# EAGLE design FT232H (EAGLE 6.5.0)
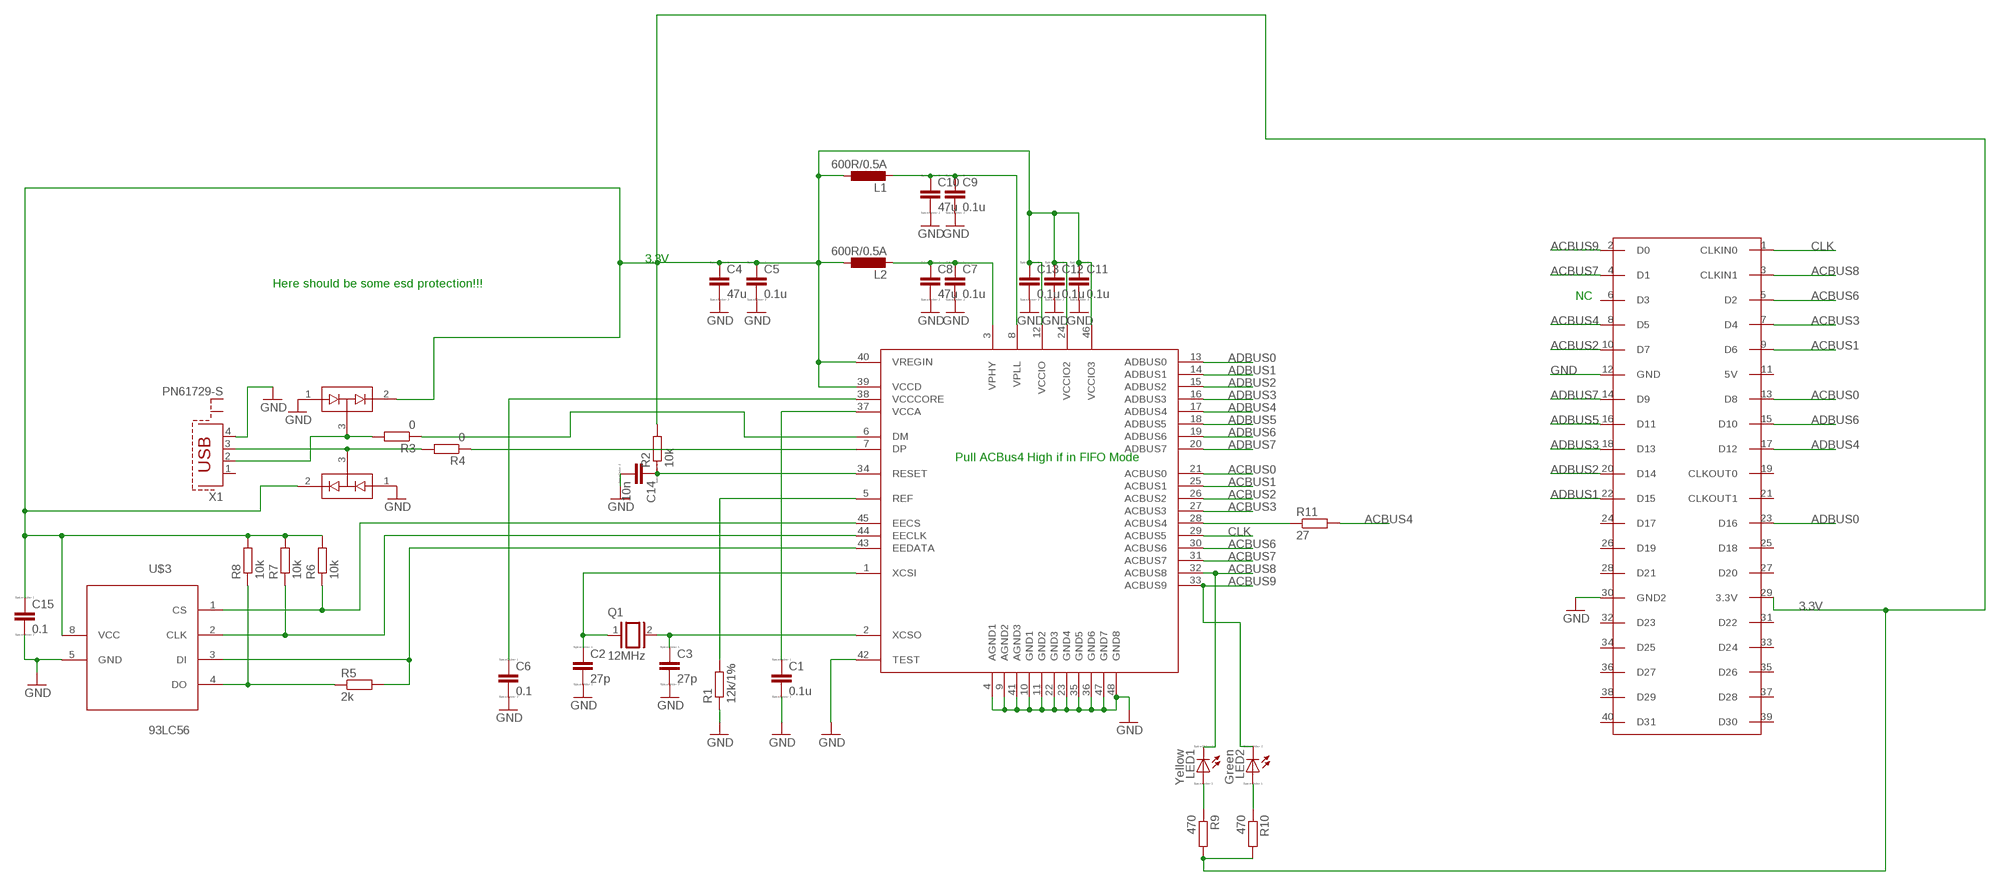
[diagram p0: schematic, sheet 1]

## Parts
C1  0.1u  C_SMD  [C0805]
C2  27p  C_SMD  [C0805]
C3  27p  C_SMD  [C0805]
C4  47u  C_SMD  [C0805]
C5  0.1u  C_SMD  [C0805]
C6  0.1  C_SMD  [C0805]
C7  0.1u  C_SMD  [C0805]
C8  47u  C_SMD  [C0805]
C9  0.1u  C_SMD  [C0805]
C10  47u  C_SMD  [C0805]
C11  0.1u  C_SMD  [C0805]
C12  0.1u  C_SMD  [C0805]
C13  0.1u  C_SMD  [C0805]
C14  10n  C_SMD  [C0805]
C15  0.1  C_SMD  [C0805]
D1  BAV99  [SOT23]
D2  BAV99  [SOT23]
L1  600R/0.5A  L_0805  [R0805]
L2  600R/0.5A  L_0805  [R0805]
LED1  Yellow  LED_ELED_0805  [R0805]
LED2  Green  LED_ELED_0805  [R0805]
Q1  12MHz  XTAL/S  [QS]
R1  12k/1%  R-EU_M0805  [M0805]
R2  10k  R-EU_M0805  [M0805]
R3  0  R-EU_M0805  [M0805]
R4  0  R-EU_M0805  [M0805]
R5  2k  R-EU_M0805  [M0805]
R6  10k  R-EU_M0805  [M0805]
R7  10k  R-EU_M0805  [M0805]
R8  10k  R-EU_M0805  [M0805]
R9  470  R-EU_M0805  [M0805]
R10  470  R-EU_M0805  [M0805]
R11  27  R-EU_M0805  [M0805]
U$1  FT232H  [LQFP48]
U$2  FPGA_GPIO_DE0  [2X20]
U$3  93LC56  [DIL-08]
X1  PN61729-S  [PN61729-S]

## Nets
3.3V: C4.1 C5.1 C11.1 C12.1 C13.1 C15.1 D1.2(C2) D2.2(C2) L1.1 L2.1 R2.2 R6.2 R7.2 R8.2 R9.2 R10.2 U$1.12(VCCIO) U$1.24(VCCIO2) U$1.39(VCCD) U$1.40(VREGIN) U$1.46(VCCIO3) U$2.29(3.3V) U$3.8(VCC)
ACBUS0: U$1.21(ACBUS0) U$2.13(D8)
ACBUS1: U$1.25(ACBUS1) U$2.9(D6)
ACBUS2: U$1.26(ACBUS2) U$2.10(D7)
ACBUS3: U$1.27(ACBUS3) U$2.7(D4)
ACBUS4: R11.2 U$2.8(D5)
ACBUS6: U$1.30(ACBUS6) U$2.5(D2)
ACBUS7: U$1.31(ACBUS7) U$2.4(D1)
ACBUS8: LED1.2(C) U$1.32(ACBUS8) U$2.3(CLKIN1)
ACBUS9: LED2.2(C) U$1.33(ACBUS9) U$2.2(D0)
ADBUS0: U$1.13(ADBUS0) U$2.23(D16)
ADBUS1: U$1.14(ADBUS1) U$2.22(D15)
ADBUS2: U$1.15(ADBUS2) U$2.20(D14)
ADBUS3: U$1.16(ADBUS3) U$2.18(D13)
ADBUS4: U$1.17(ADBUS4) U$2.17(D12)
ADBUS5: U$1.18(ADBUS5) U$2.16(D11)
ADBUS6: U$1.19(ADBUS6) U$2.15(D10)
ADBUS7: U$1.20(ADBUS7) U$2.14(D9)
CLK: U$1.29(ACBUS5) U$2.1(CLKIN0)
GND: C1.2 C2.2 C3.2 C4.2 C5.2 C6.2 C7.2 C8.2 C9.2 C10.2 C11.2 C12.2 C13.2 C14.2 C15.2 D1.1(A1) D2.1(A1) R1.1 U$1.4(AGND1) U$1.9(AGND2) U$1.10(GND1) U$1.11(GND2) U$1.22(GND3) U$1.23(GND4) U$1.35(GND5) U$1.36(GND6) U$1.41(AGND3) U$1.42(TEST) U$1.47(GND7) U$1.48(GND8) U$2.12(GND) U$2.30(GND2) U$3.5(GND) X1.4
N$1: C9.1 C10.1 L1.2 U$1.8(VPLL)
N$3: C1.1 U$1.37(VCCA)
N$4: R1.2 U$1.5(REF)
N$5: C6.1 U$1.38(VCCCORE)
N$6: C2.1 Q1.1 U$1.1(XCSI)
N$7: C3.1 Q1.2 U$1.2(XCSO)
N$8: C14.1 R2.1 U$1.34(RESET)
N$9: R4.1 U$1.7(DP)
N$11: D1.3(COM) R3.2 X1.2
N$12: R3.1 U$1.6(DM)
N$13: C7.1 C8.1 L2.2 U$1.3(VPHY)
N$14: D2.3(COM) R4.2 X1.3
N$28: R6.1 U$1.45(EECS) U$3.1(CS)
N$29: R7.1 U$1.44(EECLK) U$3.2(CLK)
N$30: R5.2 U$1.43(EEDATA) U$3.3(DI)
N$31: R5.1 R8.1 U$3.4(DO)
N$38: LED1.1(A) R9.1
N$39: LED2.1(A) R10.1
N$41: R11.1 U$1.28(ACBUS4)
Unconnected: U$2.6(D3) U$2.11(5V) U$2.19(CLKOUT0) U$2.21(CLKOUT1) U$2.24(D17) U$2.25(D18) U$2.26(D19) U$2.27(D20) U$2.28(D21) U$2.31(D22) U$2.32(D23) U$2.33(D24) U$2.34(D25) U$2.35(D26) U$2.36(D27) U$2.37(D28) U$2.38(D29) U$2.39(D30) U$2.40(D31) X1.1 X1.S1 X1.S2

## Notes on the sheet
- 3.3V
- Here should be some esd protection!!!
- NC
- Pull ACBus4 High if in FIFO Mode

## Library data of the parts
C1-C15 = 0myLib:C_SMD: CAPACITOR, European symbol; SPICEMODEL: NONE; SPICEPREFIX: C
D1 D2 = 0myLib:BAV99: Two small signal silicon diodes connected anode to cathode. Connections to all three nodes available. DIO-10647; PROD_ID: DIO-10647
L1 L2 = 0myLib:L_0805
LED1 LED2 = 0myLib:LED_E: LED Source: http://www.osram.convergy.de Source: www.luxeon.com Source: www.kingbright.com
Q1 = 0myLib:XTAL/S: CRYSTAL
R1-R11 = 0myLib:R-EU_: RESISTOR, European symbol
U$1 = 0myLib:FT232H
U$2 = 0myLib:FPGA_GPIO_DE0
U$3 = 0myLib:93LC56
X1 = 0myLib:PN61729-S: BERG USB connector; OC_FARNELL: unknown; OC_NEWARK: unknown

## Board
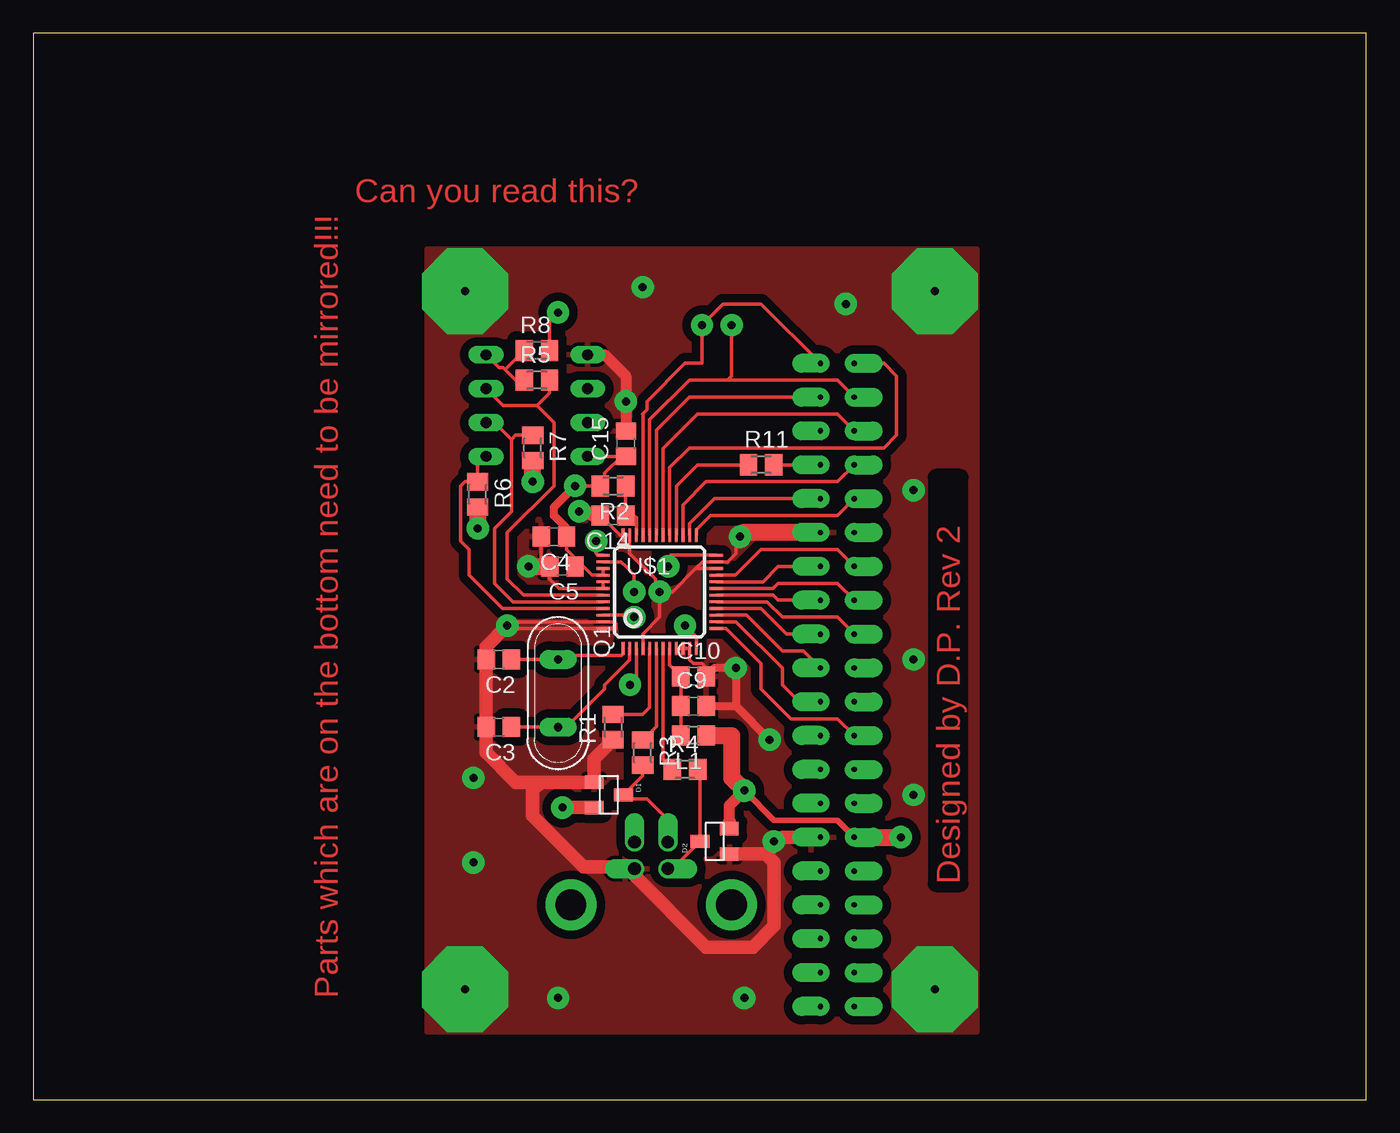
[diagram p1: board, top side]
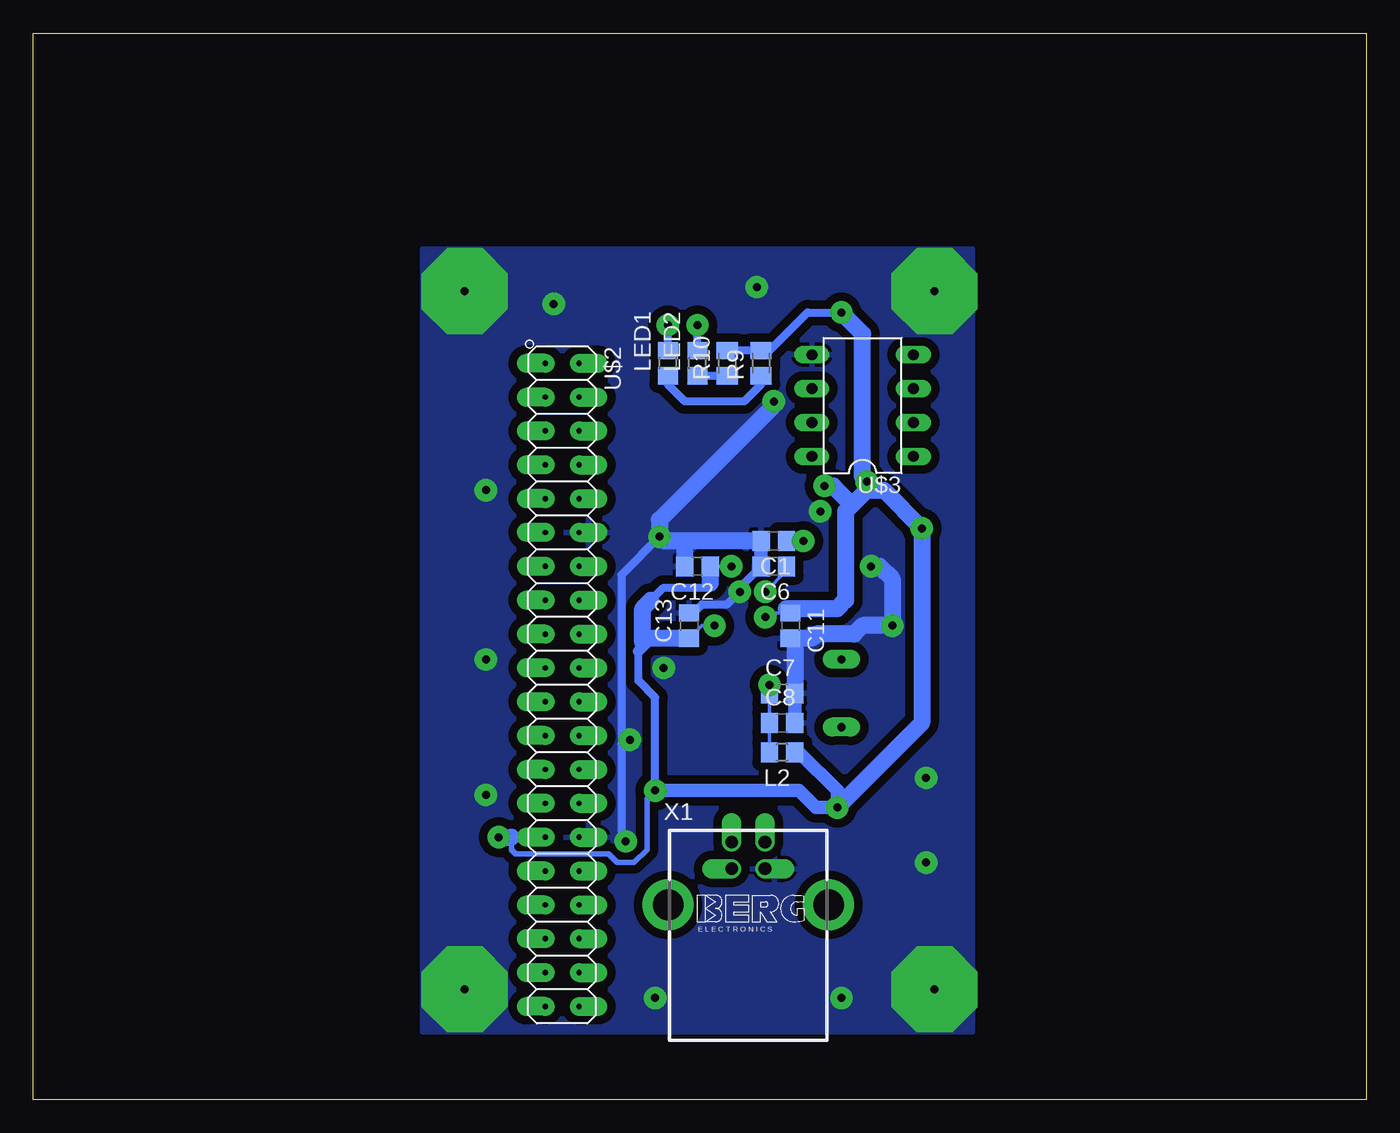
[diagram p2: board, bottom side, seen from below]

Size 100 x 80 mm. Coordinates in mm from the lower left corner, seen from the top.
Outline: 0,0 100,0 100,80 0,80 0,0
Copper layers (1*16): Top 0.035mm / dielectric 1.5mm / Bottom 0.035mm
Design rules "FinalizeAreaFill": minimum track width 12mil, minimum drill 1.4mm, track to track 25mil, track to pad 25mil, pad to pad 8mil, via to via 8mil, smd to smd 8mil, copper to edge 40mil, drill to drill 8mil, minimum pad ring 10mil, minimum via ring 8mil, stop-mask expansion 4mil, vias tented up to drill 0mil, thermal gap 10mil

### Footprints (pad centres in the part's own frame; a part is rotated, then mirrored left to right if it is on the bottom)
C0805 = smd 1.3 x 1.5: 1 -0.95,0; 2 0.95,0
SOT23 = smd 1 x 1.4: 1 -0.95,-1.1; 2 0.95,-1.1; 3 0,1.1
R0805 = smd 1.3 x 1.5: 1 -0.95,0; 2 0.95,0
QS = drill 0.61 pad 1.422 long: 1 -2.54,0; 2 2.54,0
M0805 = smd 1.3 x 1.6: 1 -0.95,0; 2 0.95,0
LQFP48 = smd 0.2 x 1: 1 -2.75,-4.25; 2 -2.25,-4.25; 3 -1.75,-4.25; 4 -1.25,-4.25; 5 -0.75,-4.25; 6 -0.25,-4.25; 7 0.25,-4.25; 8 0.75,-4.25; 9 1.25,-4.25; 10 1.75,-4.25; 11 2.25,-4.25; 12 2.75,-4.25; 25 2.75,4.25; 26 2.25,4.25; 27 1.75,4.25; 28 1.25,4.25; 29 0.75,4.25; 30 0.25,4.25; 31 -0.25,4.25; 32 -0.75,4.25; 33 -1.25,4.25; 34 -1.75,4.25; 35 -2.25,4.25; 36 -2.75,4.25 | smd 1 x 0.2: 13 4.25,-2.75; 14 4.25,-2.25; 15 4.25,-1.75; 16 4.25,-1.25; 17 4.25,-0.75; 18 4.25,-0.25; 19 4.25,0.25; 20 4.25,0.75; 21 4.25,1.25; 22 4.25,1.75; 23 4.25,2.25; 24 4.25,2.75; 37 -4.25,2.75; 38 -4.25,2.25; 39 -4.25,1.75; 40 -4.25,1.25; 41 -4.25,0.75; 42 -4.25,0.25; 43 -4.25,-0.25; 44 -4.25,-0.75; 45 -4.25,-1.25; 46 -4.25,-1.75; 47 -4.25,-2.25; 48 -4.25,-2.75
2X20 = drill 0.4 pad 1.422 offset: 1 -24.13,-1.27; 2 -24.13,1.27; 3 -21.59,-1.27; 4 -21.59,1.27; 5 -19.05,-1.27; 6 -19.05,1.27; 7 -16.51,-1.27; 8 -16.51,1.27; 9 -13.97,-1.27; 10 -13.97,1.27; 11 -11.43,-1.27; 12 -11.43,1.27; 13 -8.89,-1.27; 14 -8.89,1.27; 15 -6.35,-1.27; 16 -6.35,1.27; 17 -3.81,-1.27; 18 -3.81,1.27; 19 -1.27,-1.27; 20 -1.27,1.27; 21 1.27,-1.27; 22 1.27,1.27; 23 3.81,-1.27; 24 3.81,1.27; 25 6.35,-1.27; 26 6.35,1.27; 27 8.89,-1.27; 28 8.89,1.27; 29 11.43,-1.27; 30 11.43,1.27; 31 13.97,-1.27; 32 13.97,1.27; 33 16.51,-1.27; 34 16.51,1.27; 35 19.05,-1.27; 36 19.05,1.27; 37 21.59,-1.27; 38 21.59,1.27; 39 24.13,-1.27; 40 24.13,1.27
DIL-08 = drill 0.813 long: 1 -3.81,-3.81; 2 -1.27,-3.81; 3 1.27,-3.81; 4 3.81,-3.81; 5 3.81,3.81; 6 1.27,3.81; 7 -1.27,3.81; 8 -3.81,3.81
PN61729-S = drill 0.95 offset: 1 1.25,4.71; 2 -1.25,4.71; 3 -1.25,2.71; 4 1.25,2.71 | drill 2.3 pad 3.81: S1 -6.02,0; S2 6.02,0

### Placement (x,y rotation side)
C1  44.45,41.91 180 bottom
C2  34.92,33.02 180 top
C3  34.92,27.94 180 top
C4  39.05,42.23 180 top
C5  39.69,40.01 180 top
C6  44.45,40.01 180 bottom
C7  43.81,30.48 0 bottom
C8  43.81,28.26 0 bottom
C9  49.53,29.53 0 top
C10  49.53,31.75 0 top
C11  43.18,35.56 270 bottom
C12  50.16,40.01 180 bottom
C13  50.8,35.56 90 bottom
C14  43.5,43.81 180 top
C15  44.45,49.21 90 top
D1  43.18,22.86 270 top
D2  51.12,19.37 90 top
L1  49.53,27.3 180 top
L2  43.81,26.04 180 bottom
LED1  52.39,55.24 90 bottom
LED2  50.16,55.24 90 bottom
Q1  39.37,30.48 270 top
R1  43.5,27.94 90 top
R2  43.5,46.04 180 top
R3  45.72,26.04 270 top
R4  48.9,24.77 0 top
R5  37.78,53.98 0 top
R6  33.34,45.4 270 top
R7  37.47,48.9 270 top
R8  37.78,56.2 0 top
R9  45.4,55.24 90 bottom
R10  47.94,55.24 90 bottom
R11  54.61,47.62 0 top
U$1  46.99,38.1 0 top
U$2  60.33,31.11 270 bottom
U$3  37.78,52.07 90 bottom
X1  46.35,14.61 0 bottom

### Tracks (layer width: path | path; a pad name or v marks a point on that pad's centre or on a via)
3.3V  (via drill 0.6 pad 1.68)
  Top 0.254: U$1.39 U$1.40 41.93,39.35 41.27,40.01 C5.1 | U$1.12 49.74,34.72 v48.9,35.56 | U$1.24 47.84,40.85 47.62,40.64 v47.62,40.01 | U$1.46 44.93,36.35 v45.09,36.2 | 40.66,39.98 C5.1 | C5.1 40.64,40.64 40.01,41.27 C4.1 | U$3.8 C15.1 44.13,48.26 42.86,46.99 42.86,46.35 R2.2 v40.64,46.04 | R8.2 38.73,58.42 v39.37,59.05
  Top 0.406: v53.34,23.18 55.56,20.95 60.33,20.95 U$2.29
  Top 0.61: C4.1 40,42.87 39.05,43.81 39.05,44.45 v40.64,46.04
  Top 0.813: 52.22,20.79 52.22,22.05 v53.34,23.18
  Top 1.016: D2.2 52.22,20.79 | D1.2 v39.69,21.91
  Top 1.27: R6.2 v33.34,42.86 | v37.47,46.35 R7.2 | L1.1 52.39,27.3 52.39,24.13 v53.34,23.18 | U$2.29 v65.09,19.68
  Bottom 0.254: v48.9,35.56 49.85,35.56 C13.1 | 43.5,36.83 C11.1 44.77,36.51 v45.09,36.2 | v47.62,40.01 C12.1
  Bottom 0.406: 64.14,19.68 64.14,18.73 63.82,18.41 56.83,18.41 56.2,17.78 54.93,17.78 53.98,18.73 53.98,22.54 v53.34,23.18
  Bottom 0.61: 53.66,37.47 52.7,38.42 49.53,38.42 49.22,38.73 | v39.37,59.05 41.91,59.05 44.77,56.2 R9.2 R10.2 | v53.34,23.18 53.34,30.16 54.61,31.43 54.61,33.66
  Bottom 0.813: 54.29,34.29 54.29,33.98 54.61,33.66
  Bottom 1.016: L2.1 42.55,26.04 39.69,23.18 v39.69,21.91 41.27,21.91 42.55,23.18 v53.34,23.18
  Bottom 1.27: C12.1 49.22,38.73 | 53.66,37.47 54.29,36.83 54.29,34.61 | C13.1 54.29,34.61 | 43.5,36.83 39.69,36.83 39.05,37.47 39.05,44.13 38.58,44.61 | 37.47,45.72 v37.47,46.35 37.78,46.67 37.78,57.47 v39.37,59.05 | 37.47,45.72 38.58,44.61 | 37.47,45.72 36.2,45.72 v33.34,42.86 33.34,28.26 v39.69,21.91 | v40.64,46.04 40.01,46.04 38.58,44.61 | 54.29,34.29 54.29,34.61 | v65.09,19.68 64.14,19.68
ACBUS0
  Top 0.254: U$1.21 52.69,39.35 54.61,41.27 60.33,41.27 U$2.13
ACBUS1
  Top 0.254: U$1.25 49.74,42.76 50.8,43.81 60.33,43.81 U$2.9
ACBUS2
  Top 0.254: U$1.26 49.24,43.21 51.12,45.09 U$2.10
ACBUS3
  Top 0.254: U$2.7 60.33,46.35 50.48,46.35 48.74,44.61 U$1.27
ACBUS4
  Top 0.254: R11.2 U$2.8
ACBUS6
  Top 0.254: U$1.30 47.24,48.83 49.85,51.44 60.33,51.44 U$2.5
ACBUS7
  Top 0.254: U$1.31 46.74,50.23 49.21,52.7 U$2.4
ACBUS8  (via drill 0.6 pad 1.68)
  Top 0.254: U$1.32 46.24,51 49.21,53.98 52.07,53.98 | 52.07,53.98 60.33,53.98 U$2.3 | v52.39,58.1 52.39,54.29 52.07,53.98
  Bottom 0.61: LED1.2 v52.39,58.1
ACBUS9  (via drill 0.6 pad 1.68)
  Top 0.254: U$1.33 45.74,51.41 45.72,51.44 46.04,51.75 46.04,52.39 48.9,55.24 50.16,55.24 v50.16,58.1 51.75,59.69 54.61,59.69 U$2.2
  Bottom 0.61: LED2.2 v50.16,58.1
ADBUS0
  Top 0.254: U$1.13 51.96,35.35 54.61,32.7 54.61,30.8 56.83,28.57 60.33,28.57 U$2.23
ADBUS1
  Top 0.254: U$1.14 52.73,35.85 56.2,32.38 56.2,31.11 57.47,29.84 U$2.22
ADBUS2
  Top 0.254: U$1.15 53.5,36.35 56.2,33.66 57.78,33.66 U$2.20
ADBUS3
  Top 0.254: U$1.16 54.59,36.85 56.52,34.92 U$2.18
ADBUS4
  Top 0.254: U$1.17 55.04,37.35 56.2,36.2 60.33,36.2 U$2.17
ADBUS5
  Top 0.254: U$1.18 55.49,37.85 55.88,37.47 U$2.16
ADBUS6
  Top 0.254: U$1.19 55.49,38.35 55.88,38.73 60.33,38.73 U$2.15
ADBUS7
  Top 0.254: U$1.20 54.73,38.85 55.88,40.01 U$2.14
CLK
  Top 0.254: U$1.29 47.74,47.42 49.21,48.9 63.82,48.9 64.77,49.85 64.77,54.29 63.82,55.24 U$2.1
GND  (via drill 0.6 pad 1.68, 0.6 pad 6.45)
  Top 0.254: 49.69,39.85 50.19,40.35 U$1.23 52.1,40.35 52.7,40.96 52.7,41.91 v53.02,42.23 | 49.69,39.85 47.94,38.1 v46.99,38.1 | U$1.22 49.69,39.85 | v46.99,38.1 46.67,38.42 46.67,39.05 44.74,40.98 U$1.35 U$1.36 44.01,42.35 C14.2 | U$1.9 U$1.10 U$1.11 49.24,32.99 49.53,32.7 50.16,32.7 50.48,32.38 C10.2 | U$1.4 45.74,34.95 46.99,36.2 v46.99,38.1 | U$1.41 U$1.42 39.44,38.35 38.73,39.05 C5.2 38.1,40.64 C4.2 | U$1.48 43.71,35.35 43.71,35.72 43.57,35.85 U$1.47 35.85,35.85 v35.56,35.56 35.77,35.35 U$1.48
  Top 0.61: 52.7,29.53 v52.7,32.38 51.12,32.38 C10.2 | C9.2 52.7,29.53 | 56.2,19.68 55.88,19.68 v55.56,19.37 | 52.7,29.53 v55.24,26.99
  Top 0.813: v40.96,44.13 41.59,44.13 41.91,43.81 C14.2 | U$3.5 42.86,55.88 44.45,54.29 v44.45,52.39 C15.2
  Top 1.016: U$2.30 56.2,19.68 54.93,18.41 | 54.93,18.41 D2.1 | 54.93,18.41 55.56,17.78 55.56,13.02 53.98,11.43 50.48,11.43 45.1,16.81 X1.4 44.96,17.46 41.27,17.46 37.47,21.27 37.47,23.18 38.1,23.81 D1.1 | v35.56,35.56 33.98,33.98 C2.2 C3.2 33.97,26.04 36.2,23.81 D1.1 | D1.1 42.08,25.57 R1.1
  Top 1.27: v37.15,40.01 C5.2 | U$2.12 53.34,42.55 v53.02,42.23
  Bottom 0.61: C6.2 46.67,38.73 46.67,38.42 v46.99,38.1 47.94,37.15 49.85,37.15 50.48,36.51 C13.2 | v53.02,42.23 55.88,39.37 55.88,26.67 | 55.88,26.67 55.88,19.68 v55.56,19.37 | v55.24,26.99 55.56,26.99 55.88,26.67
  Bottom 1.016: C8.2 C7.2 | C1.2 C6.2
  Bottom 1.27: C11.2 42.87,34.3 C7.2 | v37.15,40.01 36.51,40.01 35.56,39.05 v35.56,35.56 37.78,35.56 38.42,34.92 41.27,34.92 41.59,34.61 C11.2 | C1.2 51.44,41.91 | 51.44,41.91 52.7,41.91 v53.02,42.23 53.02,43.5 44.45,52.07 v44.45,52.39 | C12.2 51.12,41.59 51.44,41.91
  other vias: 32.38,60.64 32.38,8.26 67.63,60.64 67.63,8.26 45.72,60.96 60.96,59.69 66.04,45.72 66.04,33.02 66.04,22.86 53.34,7.62 39.37,7.62 33.02,17.78 33.02,24.13
  pour Top: 29.53,5.08 29.53,63.82 70.8,63.82 70.8,5.08
  pour Bottom: 70.8,5.08 70.8,63.82 29.53,63.82 29.53,5.08
N$1
  Top 0.254: U$1.8 47.74,32.59 C10.1 C9.1 L1.2
N$3  (via drill 0.6 pad 1.68)
  Top 0.254: U$1.37 42.34,40.85 42.23,40.96 v42.23,41.91
  Bottom 0.254: v42.23,41.91 C1.1
N$4
  Top 0.254: U$1.5 46.24,29.41 45.72,28.89 R1.2
N$5  (via drill 0.6 pad 1.68)
  Top 0.254: U$1.38 44.1,40.35 44.45,40.01 45.09,39.37 v45.09,38.1
  Bottom 0.254: C6.1 43.5,39.69 v45.09,38.1
N$6
  Top 0.254: C2.1 Q1.1 39.69,33.34 44.13,33.34 44.24,33.45 U$1.1
N$7
  Top 0.254: C3.1 Q1.2 40.01,27.94 42.86,30.8 42.86,31.11 44.74,32.99 U$1.2
N$8
  Top 0.254: U$1.34 45.24,43.66 45.09,43.81 C14.1 R2.1
N$9
  Top 0.254: U$1.7 47.24,25.47 R4.1
N$11
  Top 0.254: X1.2 47.6,20.98 46.04,22.54 44.6,22.54 D1.3 45.72,24.3 R3.2
N$12
  Top 0.254: U$1.6 46.74,28 R3.1
N$13  (via drill 0.6 pad 1.68)
  Top 0.254: U$1.3 45.24,31.59 v44.77,31.11
  Bottom 0.254: C7.1 44.77,30.8 | C7.1 v44.77,31.11 | C7.1 C8.1 L2.2
N$14
  Top 0.254: R4.2 50.02,24.59 D2.3 47.97,17.32 X1.3
N$28
  Top 0.254: U$1.45 35.22,36.85 32.7,39.37 32.7,41.27 32.07,41.91 32.07,46.04 32.38,46.35 R6.1 33.34,47.62 U$3.1 34.61,48.26 34.92,47.94
N$29
  Top 0.254: 35.88,49.53 34.61,50.8 U$3.2 | U$1.44 35.99,37.35 34.61,38.73 34.61,42.86 35.88,44.13 35.88,49.53 | R7.1 36.19,49.84 35.88,49.53
N$30
  Top 0.254: U$1.43 36.76,37.85 35.56,39.05 35.56,42.55 39.05,46.04 39.05,50.8 37.78,52.07 | R5.2 38.73,53.02 37.78,52.07 | 37.78,52.07 35.24,52.07 U$3.3
N$31
  Top 0.254: U$3.4 34.92,54.93 35.24,54.93 35.4,54.77 | R5.1 36.2,53.98 35.4,54.77 | R8.1 35.4,54.77
N$38
  Bottom 0.61: R9.1 45.4,53.66 46.67,52.39 51.12,52.39 52.39,53.66 LED1.1
N$39
  Bottom 0.61: R10.1 LED2.1
N$41
  Top 0.254: U$1.28 48.24,46.02 49.85,47.62 R11.1

### Text on the board
Top: Can you read this? | Designed by D.P. Rev 2 | Parts which are on the bottom need to be mirrored!!!